# Altium schematic sheet Connector.SchDoc
size A4
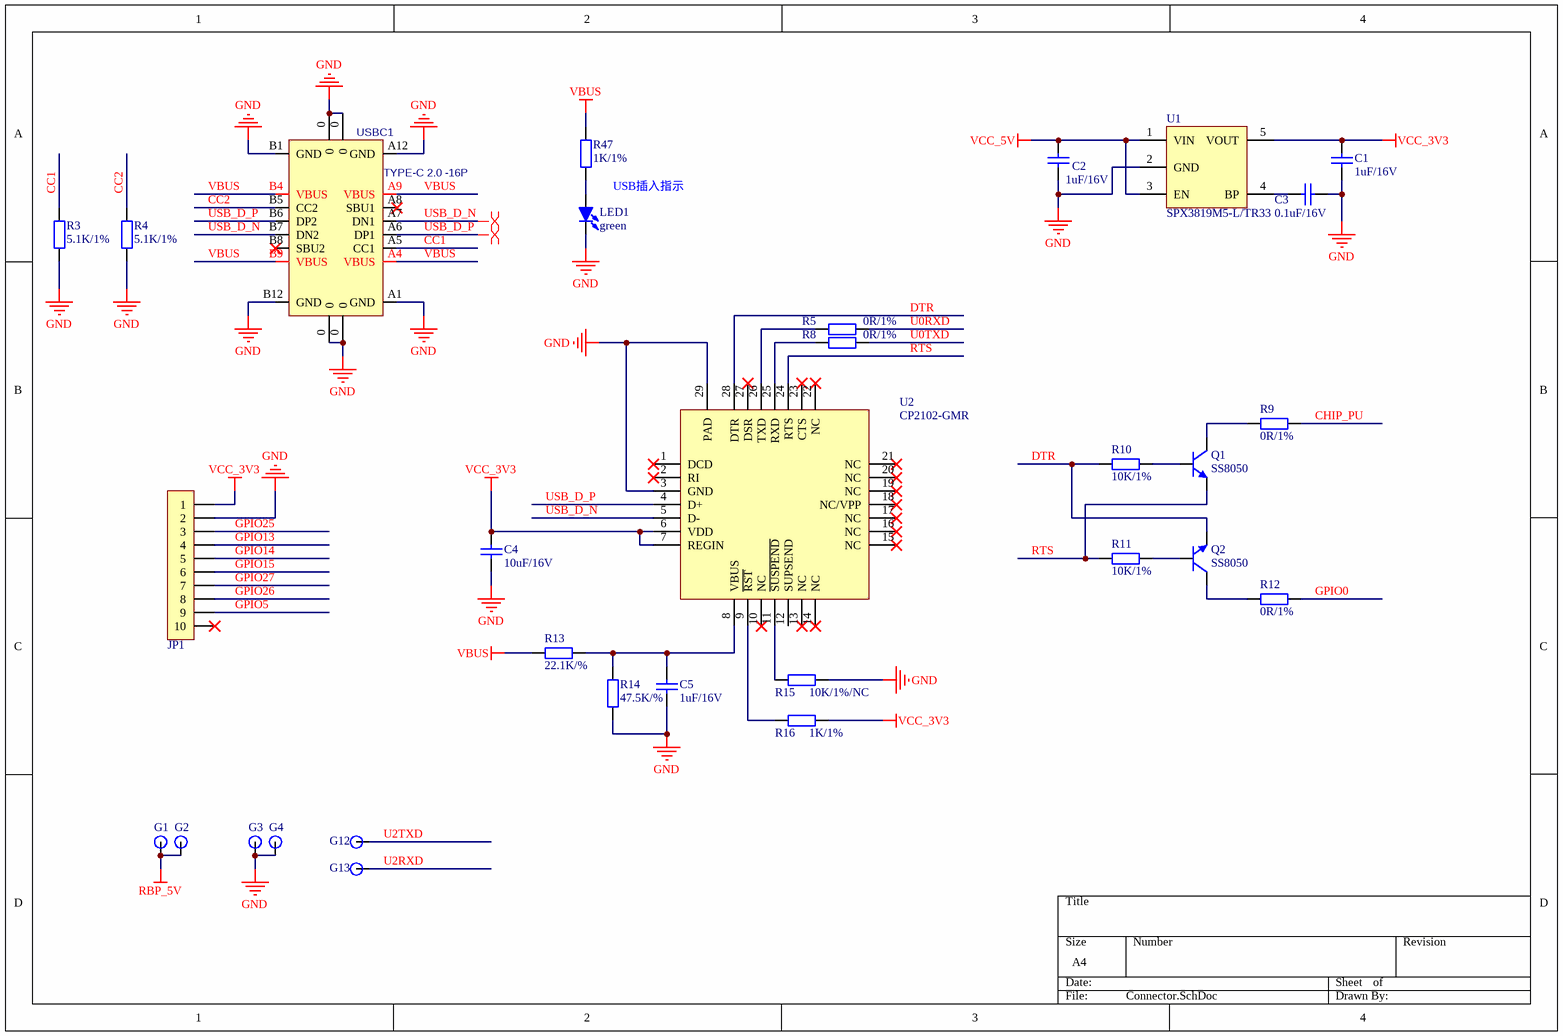
[diagram p0: Connector.SchDoc]

## Parts
C1  1uF/16V  [C0402_L]
C2  1uF/16V  [C0402_L]
C3  0.1uF/16V  [C0402_L]
C4  10uF/16V  [C0603_L]
C5  1uF/16V  [C0402_L]
G1  RBP_GPIO  [PA100-A3]  (value not drawn)
G2  RBP_GPIO  [PA100-A3]  (value not drawn)
G3  RBP_GPIO  [PA100-A3]  (value not drawn)
G4  RBP_GPIO  [PA100-A3]  (value not drawn)
G12  RBP_GPIO  [PA100-A3]  (value not drawn)
G13  RBP_GPIO  [PA100-A3]  (value not drawn)
JP1  CON-10P  [SH1.0-WT-10P]  (value not drawn)
LED1  green  [LED0402]
Q1  SS8050  [SOT23-3L]
Q2  SS8050  [SOT23-3L]
R3  5.1K/1%  [R0402_L]
R4  5.1K/1%  [R0402_L]
R5  0R/1%  [R0402_L]
R8  0R/1%  [R0402_L]
R9  0R/1%  [R0402_L]
R10  10K/1%  [R0402_L]
R11  10K/1%  [R0402_L]
R12  0R/1%  [R0402_L]
R13  22.1K/%  [R0402_L]
R14  47.5K/%  [R0402_L]
R15  10K/1%/NC  [R0402_L]
R16  1K/1%  [R0402_L]
R47  1K/1%  [R0402_L]
U1  SPX3819M5-L/TR33  [SOT23-5L]
U2  CP2102-GMR  [QFN28 5x5_L]
USBC1  TYPE-C 2.0 -16P  [USB-C-SMD_16P]

## Nets
GND: C1.2 C2.1 C3.2 C4.1 C5.1 G3.1 G4.1 JP1.2 LED1.2(K) R3.1 R4.1 R14.1 R15.2 U1.2(GND) U2.3(GND) U2.29(PAD) USBC1.0 USBC1.A1(GND) USBC1.A12(GND) USBC1.B1(GND) USBC1.B12(GND)
RBP_5V: G1.1 G2.1
VBUS: R13.1 R47.1 USBC1.A4(VBUS) USBC1.A9(VBUS) USBC1.B4(VBUS) USBC1.B9(VBUS)
VCC_3V3: C1.1 C4.2 JP1.1 R16.2 U1.5(VOUT) U2.6(VDD) U2.7(REGIN)
VCC_5V: C2.2 U1.1(VIN) U1.3(EN)
CC1: R3.2 USBC1.A5(CC1)
CC2: R4.2 USBC1.B5(CC2)
CHIP_PU: R9.2
DTR: Q2.2(E) R10.1 U2.28(DTR)
GPIO0: R12.2
GPIO5: JP1.9
GPIO13: JP1.4
GPIO14: JP1.5
GPIO15: JP1.6
GPIO25: JP1.3
GPIO26: JP1.8
GPIO27: JP1.7
RTS: Q1.2(E) R11.1 U2.24(RTS)
U0RXD: R5.2
U0TXD: R8.2
U2RXD: G13.1
U2TXD: G12.1
USB_D_N: U2.5(D-) USBC1.A7(DN1) USBC1.B7(DN2)
USB_D_P: U2.4(D+) USBC1.A6(DP1) USBC1.B6(DP2)
NetC3_1: C3.1 U1.4(BP)
NetC5_2: C5.2 R13.2 R14.2 U2.8(VBUS)
NetLED1_1: LED1.1(A) R47.2
NetQ1_1: Q1.1(B) R10.2
NetQ1_3: Q1.3(C) R9.1
NetQ2_1: Q2.1(B) R11.2
NetQ2_3: Q2.3(C) R12.1
NetR5_1: R5.1 U2.26(TXD)
NetR8_1: R8.1 U2.25(RXD)
NetR15_1: R15.1 U2.11(~{SUSPEND})
NetR16_1: R16.1 U2.9(~{RST})

Not connected (* = marked no-connect by the designer): JP1 10*; U2 1(DCD)* 2(RI)* 10(NC)* 12(SUPSEND) 13(NC)* 14(NC)* 15(NC)* 16(NC)* 17(NC)* 18(NC/VPP)* 19(NC)* 20(NC)* 21(NC)* 22(NC)* 23(CTS)* 27(DSR)*; USBC1 A8(SBU1)* B8(SBU2)*

## Layout directives
differential pair: USB_D_N, USB_D_P

## Notes on the sheet
- USB插入指示

## Library data of the parts
C1-C5 = C: 贴片电容; BOM名称: 无极性贴片电容; 联系卖家，免费查找封装: 唯一出售店铺网址https://shop463601444.taobao.com
JP1 = Header 10: 10P连接器; 联系卖家 免费查找封装: 唯一出售店铺网址https://shop463601444.taobao.com; 联系卖家 免费技术支持: 封装库来自淘宝卖家ID：黄晶宝石; BOM名称: 10P连接器
LED1 = LED-SMD: 贴片LED; 联系卖家 免费查找封装: 封装库来自淘宝卖家ID：黄晶宝石; BOM名称: 贴片LED
Q1 Q2 = 8050-SMD: 高频放大-NPN型; 联系卖家，免费查找封装: 唯一出售店铺网址https://shop463601444.taobao.com; 参数: 40V 1.5A 1W 100MHZ; BOM名称: 高频放大-NPN型
R3-R5 R8-R16 R47 = R: 贴片电阻; 联系卖家，免费查找封装: 唯一出售店铺网址https://shop463601444.taobao.com; BOM名称: 贴片电阻
U1 = SPX3819M5: 500ma-LDO
U2 = CP2102-GMR: USB-TTL
USBC1 = USB2.0_Type-C_16Pin: USB2.0_Type-C_16Pin母座; 联系卖家 免费查找封装: 唯一出售店铺网址https://shop463601444.taobao.com; 联系卖家 免费技术支持: 封装库来自淘宝卖家ID：黄晶宝石